# EAGLE design BoosterPack (EAGLE 9.6.2)
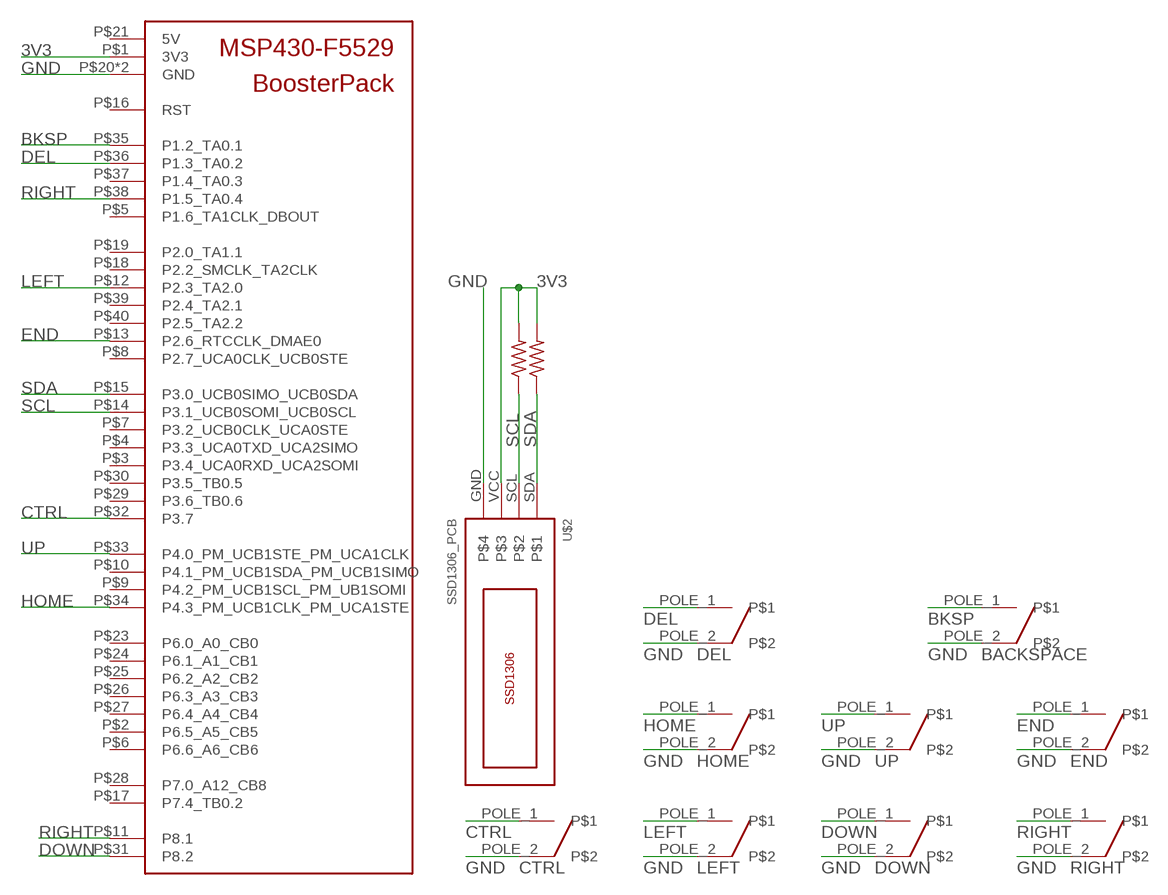
[diagram p0: schematic, sheet 1]

## Parts
BACKSPACE  CHERRY_MX  [CHERRY_MX]
CTRL  CHERRY_MX  [CHERRY_MX]
DEL  CHERRY_MX  [CHERRY_MX]
DOWN  CHERRY_MX  [CHERRY_MX]
END  CHERRY_MX  [CHERRY_MX]
HOME  CHERRY_MX  [CHERRY_MX]
LEFT  CHERRY_MX  [CHERRY_MX]
R1  R-US_0207/10  [0207/10]
R2  R-US_0207/10  [0207/10]
RIGHT  CHERRY_MX  [CHERRY_MX]
U$1  MSP430_F5529_BOOSTERPACK  [LAUNCHPAD_40PIN]
U$2  SSD1306_PCB  [SSD1306_PCB]
UP  CHERRY_MX  [CHERRY_MX]

## Nets
3V3 [power]: R1.2 R2.2 U$1.P$1(3V3) U$2.VCC
BKSP: BACKSPACE.POLE_1 U$1.P$35(P1.2_TA0.1)
CTRL: CTRL.POLE_1 U$1.P$32(P3.7)
DEL: DEL.POLE_1 U$1.P$36(P1.3_TA0.2)
DOWN: DOWN.POLE_1 U$1.P$31(P8.2)
END: END.POLE_1 U$1.P$13(P2.6_RTCCLK_DMAE0)
GND: BACKSPACE.POLE_2 CTRL.POLE_2 DEL.POLE_2 DOWN.POLE_2 END.POLE_2 HOME.POLE_2 LEFT.POLE_2 RIGHT.POLE_2 U$1.P$20(GND) U$1.P$22(GND) U$2.GND UP.POLE_2
HOME: HOME.POLE_1 U$1.P$34(P4.3_PM_UCB1CLK_PM_UCA1STE)
LEFT: LEFT.POLE_1 U$1.P$12(P2.3_TA2.0)
RIGHT: RIGHT.POLE_1 U$1.P$11(P8.1) U$1.P$38(P1.5_TA0.4)
SCL: R2.1 U$1.P$14(P3.1_UCB0SOMI_UCB0SCL) U$2.SCL
SDA: R1.1 U$1.P$15(P3.0_UCB0SIMO_UCB0SDA) U$2.SDA
UP: U$1.P$33(P4.0_PM_UCB1STE_PM_UCA1CLK) UP.POLE_1
Unconnected: U$1.P$2(P6.5_A5_CB5) U$1.P$3(P3.4_UCA0RXD_UCA2SOMI) U$1.P$4(P3.3_UCA0TXD_UCA2SIMO) U$1.P$5(P1.6_TA1CLK_DBOUT) U$1.P$6(P6.6_A6_CB6) U$1.P$7(P3.2_UCB0CLK_UCA0STE) U$1.P$8(P2.7_UCA0CLK_UCB0STE) U$1.P$9(P4.2_PM_UCB1SCL_PM_UB1SOMI) U$1.P$10(P4.1_PM_UCB1SDA_PM_UCB1SIMO) U$1.P$16(RST) U$1.P$17(P7.4_TB0.2) U$1.P$18(P2.2_SMCLK_TA2CLK) U$1.P$19(P2.0_TA1.1) U$1.P$21(5V) U$1.P$23(P6.0_A0_CB0) U$1.P$24(P6.1_A1_CB1) U$1.P$25(P6.2_A2_CB2) U$1.P$26(P6.3_A3_CB3) U$1.P$27(P6.4_A4_CB4) U$1.P$28(P7.0_A12_CB8) U$1.P$29(P3.6_TB0.6) U$1.P$30(P3.5_TB0.5) U$1.P$37(P1.4_TA0.3) U$1.P$39(P2.4_TA2.1) U$1.P$40(P2.5_TA2.2)

## Library data of the parts
BACKSPACE CTRL DEL DOWN END HOME LEFT RIGHT UP = mr_dr_prof_bolt:CHERRY_MX
R1 R2 = adafruit:R-US_: RESISTOR, American symbol
U$1 = mr_dr_prof_bolt:MSP430_F5529_BOOSTERPACK
U$2 = mr_dr_prof_bolt:SSD1306_PCB

## Net classes
0 signal: width 0.305 mm
1 power: width 0.61 mm

## Board
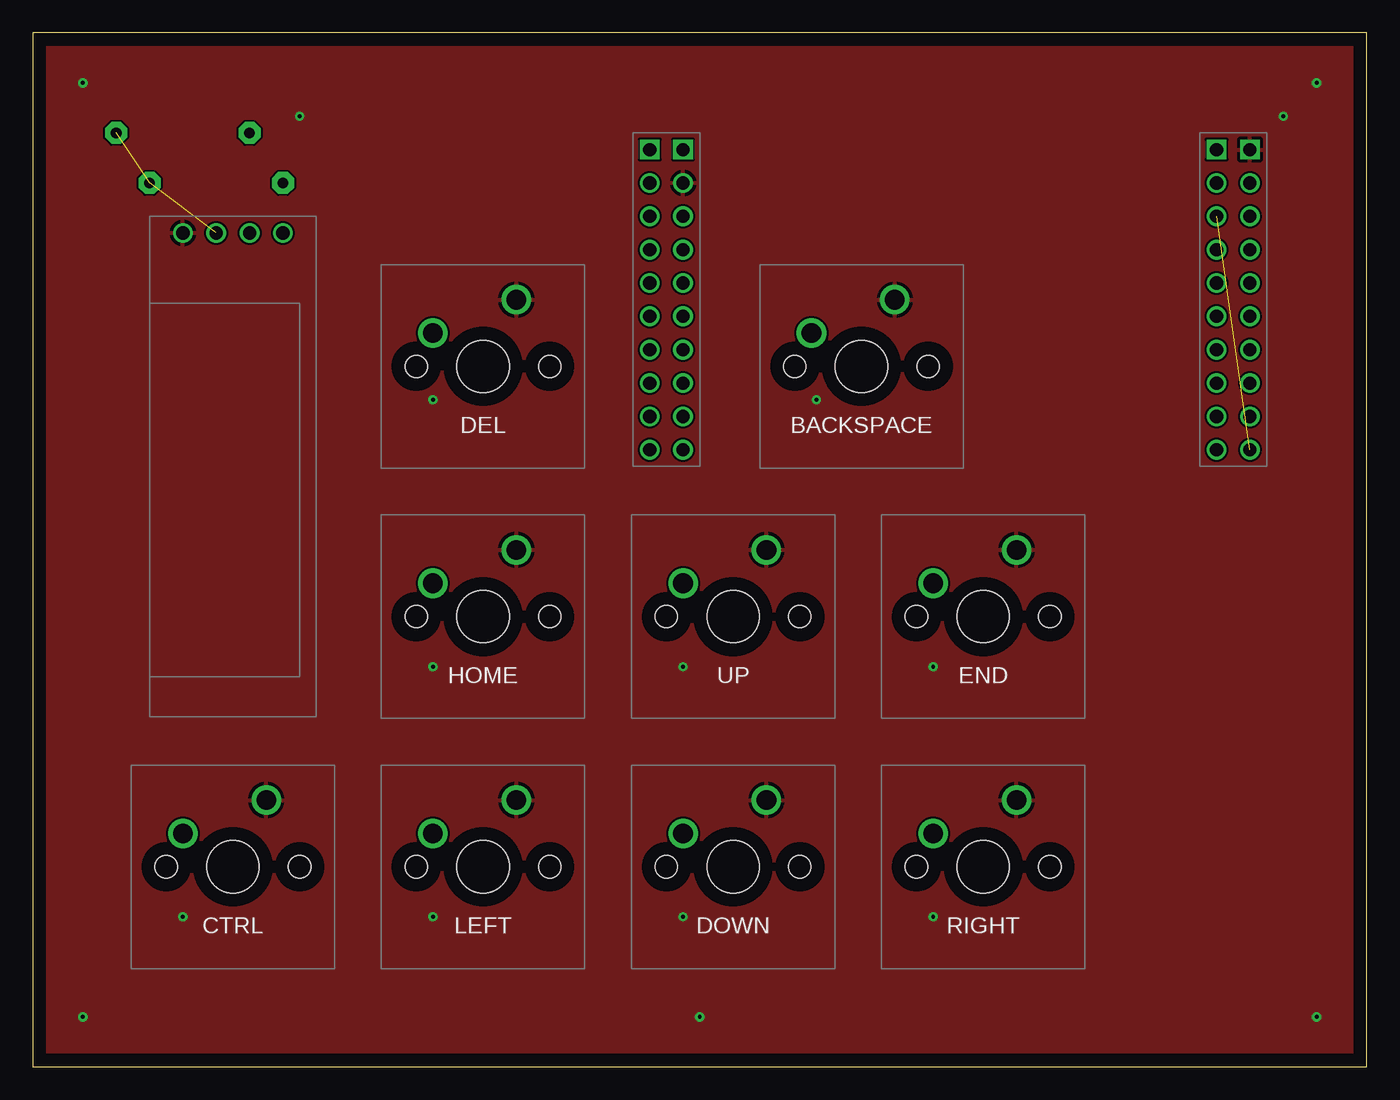
[diagram p1: board, top side]
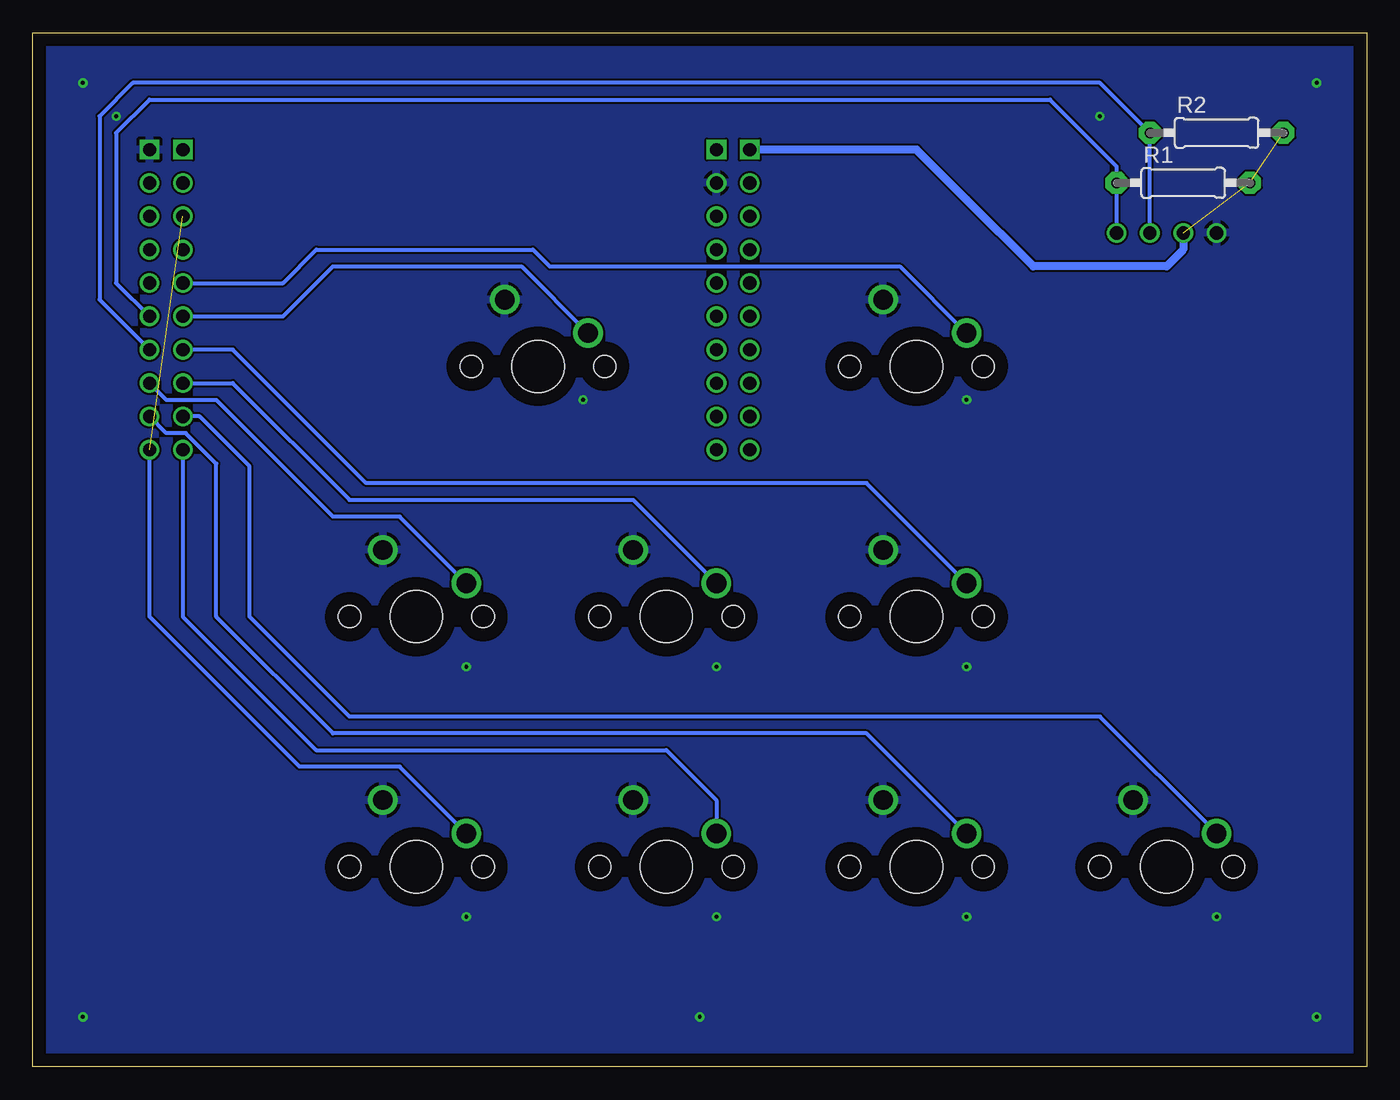
[diagram p2: board, bottom side, seen from below]

Size 101.6 x 78.74 mm. Coordinates in mm from the lower left corner, seen from the top.
Outline: 0,0 101.6,0 101.6,78.74 0,78.74 0,0
Copper layers (1*16): Top 0.035mm / dielectric 1.5mm / Bottom 0.035mm
Design rules "default *": minimum track width 6mil, minimum drill 0.35mm, track to track 6mil, track to pad 6mil, pad to pad 6mil, via to via 6mil, smd to smd 6mil, copper to edge 40mil, drill to drill 6mil, minimum pad ring 10mil, minimum via ring 8mil, stop-mask expansion 4mil, vias tented up to drill 12mil, thermal gap 10mil

### Footprints (pad centres in the part's own frame; a part is rotated, then mirrored left to right if it is on the bottom)
CHERRY_MX = drill 1.499: POLE_1 -3.81,2.54; POLE_2 2.54,5.08 | hole 3.988: 0,0 | hole 1.702: -5.08,0; 5.08,0
0207/10 = drill 0.813 pad 1.676 octagon: 1 -5.08,0; 2 5.08,0
LAUNCHPAD_40PIN = drill 1 square: P$1 0,22.86; P$20 45.72,22.86; P$21 2.54,22.86; P$40 43.18,22.86 | drill 1: P$2 0,20.32; P$3 0,17.78; P$4 0,15.24; P$5 0,12.7; P$6 0,10.16; P$7 0,7.62; P$8 0,5.08; P$9 0,2.54; P$10 0,0; P$11 45.72,0; P$12 45.72,2.54; P$13 45.72,5.08; P$14 45.72,7.62; P$15 45.72,10.16; P$16 45.72,12.7; P$17 45.72,15.24; P$18 45.72,17.78; P$19 45.72,20.32; P$22 2.54,20.32; P$23 2.54,17.78; P$24 2.54,15.24; P$25 2.54,12.7; P$26 2.54,10.16; P$27 2.54,7.62; P$28 2.54,5.08; P$29 2.54,2.54; P$30 2.54,0; P$31 43.18,0; P$32 43.18,2.54; P$33 43.18,5.08; P$34 43.18,7.62; P$35 43.18,10.16; P$36 43.18,12.7; P$37 43.18,15.24; P$38 43.18,17.78; P$39 43.18,20.32
SSD1306_PCB = drill 1: GND 0,0; SCL 0,5.08; SDA 0,7.62; VCC 0,2.54

### Placement (x,y rotation side)
BACKSPACE  63.12,53.34 0 top
CTRL  15.24,15.24 0 top
DEL  34.29,53.34 0 top
DOWN  53.34,15.24 0 top
END  72.39,34.29 0 top
HOME  34.29,34.29 0 top
LEFT  34.29,15.24 0 top
R1  13.97,67.31 0 bottom
R2  11.43,71.12 0 bottom
RIGHT  72.39,15.24 0 top
U$1  46.99,46.99 0 top
U$2  11.43,63.5 270 top
UP  53.34,34.29 0 top

### Tracks (layer width: path | path; a pad name or v marks a point on that pad's centre or on a via)
3V3  (2 unrouted)
  Bottom 0.61: U$2.VCC 13.97,62.23 15.24,60.96 25.4,60.96 30.48,66.04 34.29,69.85 U$1.P$1
BKSP
  Bottom 0.305: U$1.P$35 82.55,57.15 78.74,60.96 64.39,60.96 BACKSPACE.POLE_1
CTRL
  Bottom 0.305: CTRL.POLE_1 20.32,26.67 77.47,26.67 85.09,34.29 85.09,45.72 88.9,49.53 U$1.P$32
DEL
  Bottom 0.305: U$1.P$36 82.55,59.69 80.01,62.23 63.5,62.23 62.23,60.96 35.56,60.96 DEL.POLE_1
DOWN
  Bottom 0.305: U$1.P$31 90.17,34.29 80.01,24.13 53.34,24.13 49.53,20.32 DOWN.POLE_1
END
  Bottom 0.305: U$1.P$13 91.44,50.8 87.63,50.8 78.74,41.91 73.66,41.91 END.POLE_1
GND  (via drill 0.3)
  other vias: 3.81,3.81 97.79,74.93 3.81,74.93 97.79,3.81 68.58,30.48 49.53,30.48 30.48,30.48 30.48,11.43 49.53,11.43 68.58,11.43 11.43,11.43 59.69,50.8 30.48,50.8 20.32,72.39 95.25,72.39 50.8,3.81
  pour Bottom: 0,78.74 101.6,78.74 101.6,0 0,0
  pour Top: 0,78.74 101.6,78.74 101.6,0 0,0
HOME
  Bottom 0.305: HOME.POLE_1 38.1,44.45 76.2,44.45 86.36,54.61 U$1.P$34
LEFT
  Bottom 0.305: LEFT.POLE_1 38.1,25.4 78.74,25.4 87.63,34.29 87.63,45.95 89.94,48.26 91.44,48.26 U$1.P$12
RIGHT  (1 unrouted)
  Bottom 0.305: RIGHT.POLE_1 73.66,22.86 81.28,22.86 92.71,34.29 U$1.P$11
SCL
  Bottom 0.305: U$1.P$14 96.52,58.42 96.52,72.39 93.98,74.93 20.32,74.93 R2.1 U$2.SCL
SDA
  Bottom 0.305: U$1.P$15 95.25,59.69 95.25,71.12 92.71,73.66 24.13,73.66 19.05,68.58 R1.1 U$2.SDA
UP
  Bottom 0.305: U$1.P$33 86.36,52.07 77.47,43.18 55.88,43.18 UP.POLE_1

### Text on the board
tStop: UiSBad Pad | USB HID